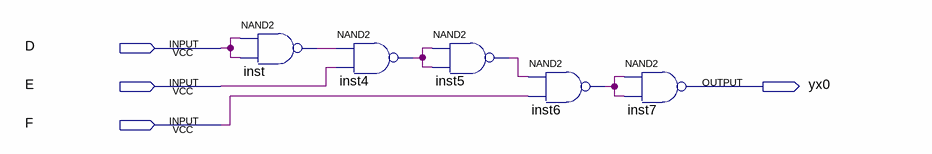
[diagram p0: schematic sheet]
// Quartus schematic DZ1_Quartus_DC_RE_yx0.bdf as structural Verilog: 5 symbols, 4 pins
module DZ1_Quartus_DC_RE_yx0 (
  input  D,
  input  E,
  input  F,
  output yx0
);

  wire inst4_out, inst5_out, inst6_out, inst_out;

  nand inst (inst_out, D, D);
  nand inst4 (inst4_out, inst_out, E);
  nand inst5 (inst5_out, inst4_out, inst4_out);
  nand inst6 (inst6_out, inst5_out, F);
  nand inst7 (yx0, inst6_out, inst6_out);
endmodule
